# Altium schematic sheet full_adder_4_bit.SchDoc
size 111 x 66 mm
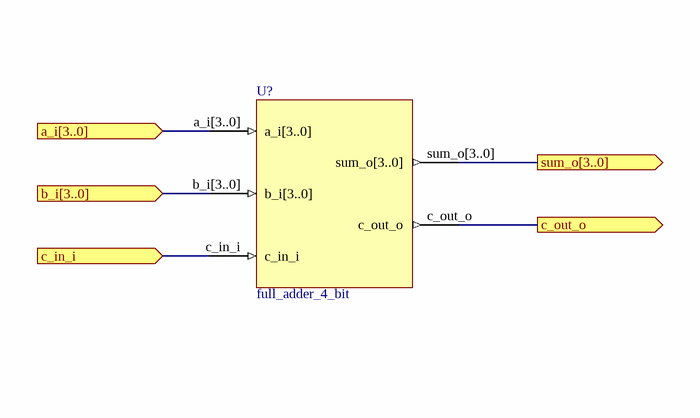
[diagram p0: full_adder_4_bit.SchDoc]

## Parts
U?  full_adder_4_bit

## Ports
a_i[3..0] (in), b_i[3..0] (in), c_in_i (in), c_out_o (out), sum_o[3..0] (out)

## Nets
a_i[3..0]: U?.a_i[3..0] ; port a_i[3..0]
b_i[3..0]: U?.b_i[3..0] ; port b_i[3..0]
c_in_i: U?.c_in_i ; port c_in_i
c_out_o: U?.c_out_o ; port c_out_o
sum_o[3..0]: U?.sum_o[3..0] ; port sum_o[3..0]